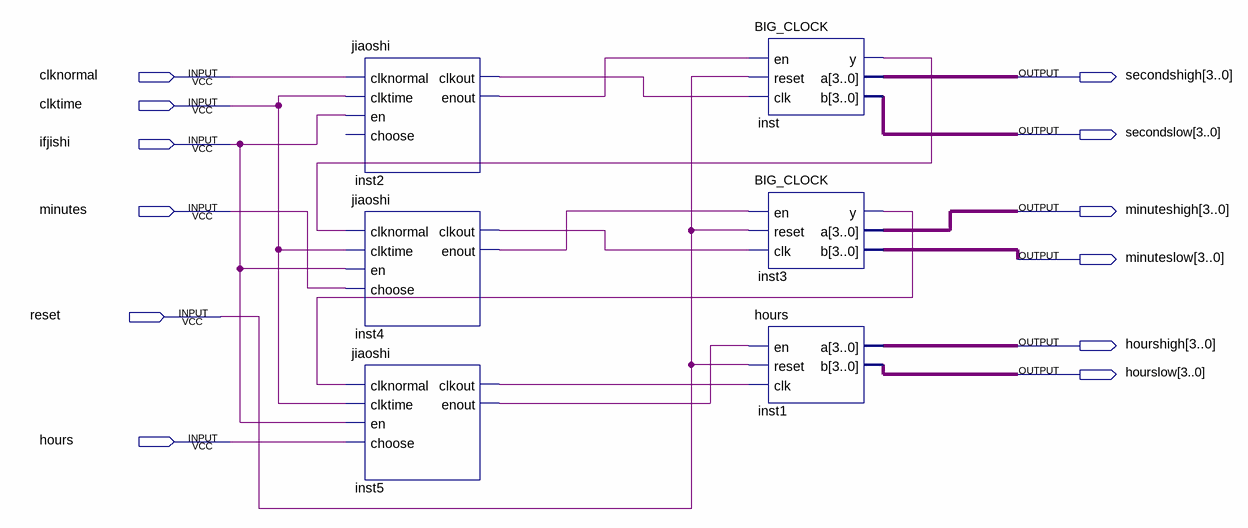
[diagram p0: schematic sheet]
// Quartus schematic Block1.bdf as structural Verilog: 6 symbols, 12 pins
module Block1 (
  input  clknormal,
  input  clktime,
  input  ifjishi,
  input  minutes,
  input  reset,
  input  hours,
  output [3:0] secondshigh,
  output [3:0] secondslow,
  output [3:0] minuteshigh,
  output [3:0] minuteslow,
  output [3:0] hourshigh,
  output [3:0] hourslow
);

  wire inst2_clkout, inst2_enout, inst3_y, inst4_clkout, inst4_enout, inst5_clkout, inst5_enout, inst_y;

  jiaoshi inst2 (
    .clknormal(clknormal), .clktime(clktime), .en(ifjishi), .clkout(inst2_clkout), .enout(inst2_enout));  // open: choose
  jiaoshi inst4 (
    .clknormal(inst_y), .clktime(clktime), .en(ifjishi), .choose(minutes), .clkout(inst4_clkout),
    .enout(inst4_enout));
  jiaoshi inst5 (
    .clknormal(inst3_y), .clktime(clktime), .en(ifjishi), .choose(hours), .clkout(inst5_clkout),
    .enout(inst5_enout));
  BIG_CLOCK inst (.en(inst2_enout), .reset(reset), .clk(inst2_clkout), .y(inst_y), .a(secondshigh), .b(secondslow));
  BIG_CLOCK inst3 (.en(inst4_enout), .reset(reset), .clk(inst4_clkout), .y(inst3_y), .a(minuteshigh), .b(minuteslow));
  hours inst1 (.en(inst5_enout), .reset(reset), .clk(inst5_clkout), .a(hourshigh), .b(hourslow));
endmodule
